# EAGLE design PTH + SMD Vibrator (EAGLE 5.08)
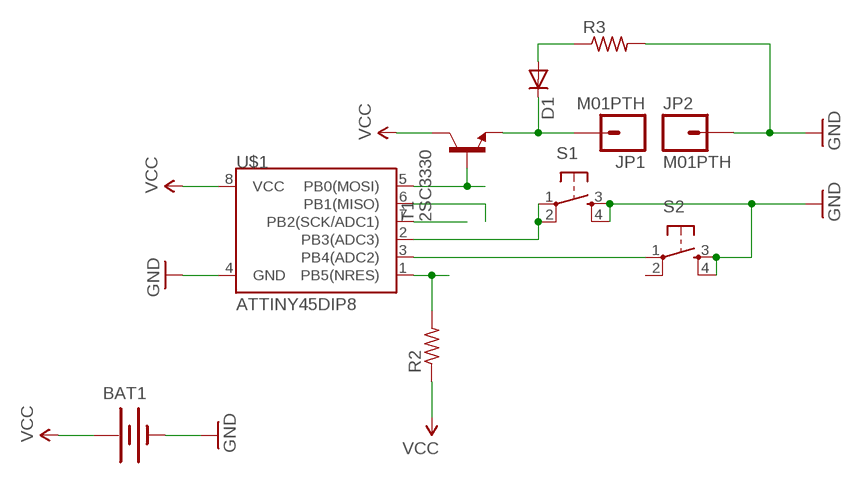
[diagram p0: schematic, sheet 1]

## Parts
BAT1  BATTERY20PTH  [BATTCOM_20MM_PTH]
D1  DIODESOD  [SOD-323]
JP1  M01PTH  [1X01]
JP2  M01PTH  [1X01]
R2  R-US_R1206  [R1206]
R3  R-US_R1206  [R1206]
S1  TAC_SWITCHPTH  [TACTILE-PTH]
S2  TAC_SWITCHPTH  [TACTILE-PTH]
T1  2SC3330  [TO92-ECB]
U$1  ATTINY45DIP8  [DIP08]

## Nets
BUTTON1_NET: S1.1 S1.2 U$1.2(PB3(ADC3))
BUTTON2_NET: S2.1 U$1.3(PB4(ADC2))
GND: BAT1.2(-) JP2.1 R3.2 S1.3 S1.4 S2.3 S2.4 U$1.4(GND)
MISO_NET: U$1.6(PB1(MISO))
MOSI_NET: T1.B U$1.5(PB0(MOSI))
N$2: D1.2(A) R3.1
N$4: D1.1(C) JP1.1 T1.E
RESET_NET: R2.2 U$1.1(PB5(NRES))
SCK_NET: U$1.7(PB2(SCK/ADC1))
VCC: BAT1.1(+) R2.1 T1.C U$1.8(VCC)
Unconnected: S2.2

## Library data of the parts
BAT1 = SparkFun:BATTERY: Battery Holders Various common sizes : AA, AAA, 20mm coin cell and 12mm coin cell.
D1 = SparkFun:DIODE: Diode These are standard reverse protection diodes and small signal diodes. SMA package can handle up to about 1A. SOD-323 can handle about 200mA. What the SOD-323 package when ordering, there are some mfgs out there that are 5-pin packages.
JP1 JP2 = SparkFun:M01: Header 1 Standard 1-pin 0.1" header. Use with straight break away headers (SKU : PRT-00116), right angle break away headers (PRT-00553), swiss pins (PRT-00743), machine pins (PRT-00117), and female headers (PRT-00115).
R2 R3 = resistor:R-US_: RESISTOR, American symbol
S1 S2 = SparkFun:TAC_SWITCH: Momentary Switch Button commonly used for reset or general input. Spark Fun Electronics SKU : COM-00097
T1 = Mine:2SC3330: NPN Silicon Epitaxial Planar Transistor Source: SEMTECH ELECTRONICS LTD. ... 2SC3330 .pdf
U$1 = SparkFun:ATTINY45: Atmel ATTiny45

## Board
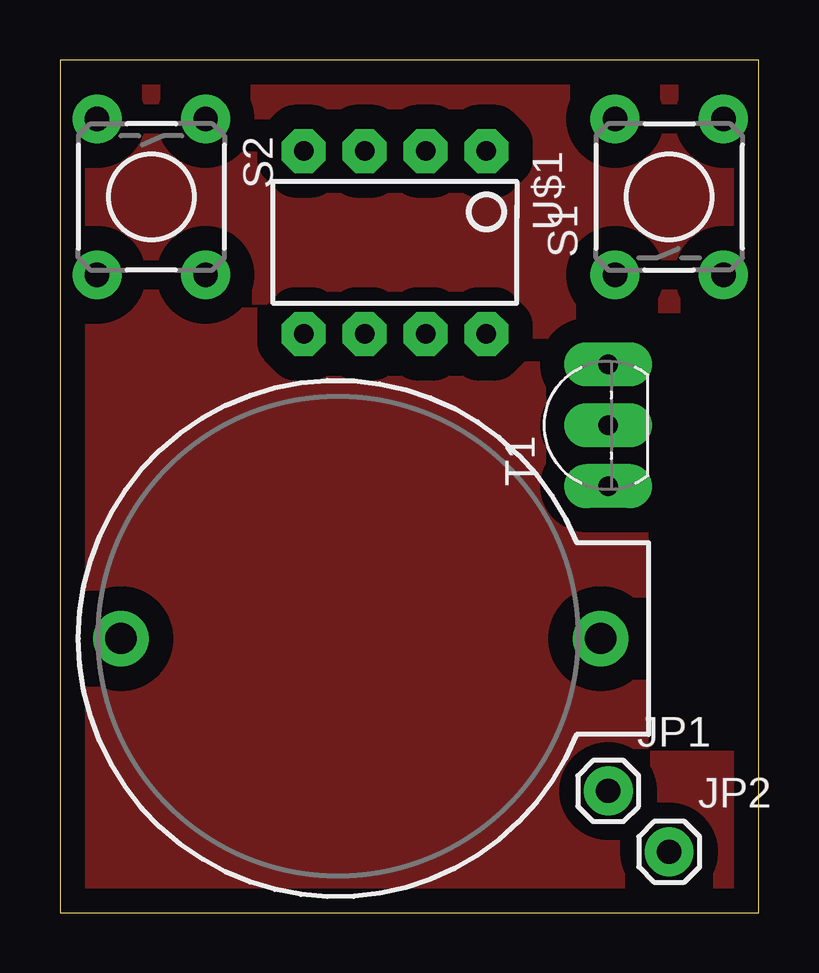
[diagram p1: board, top side]
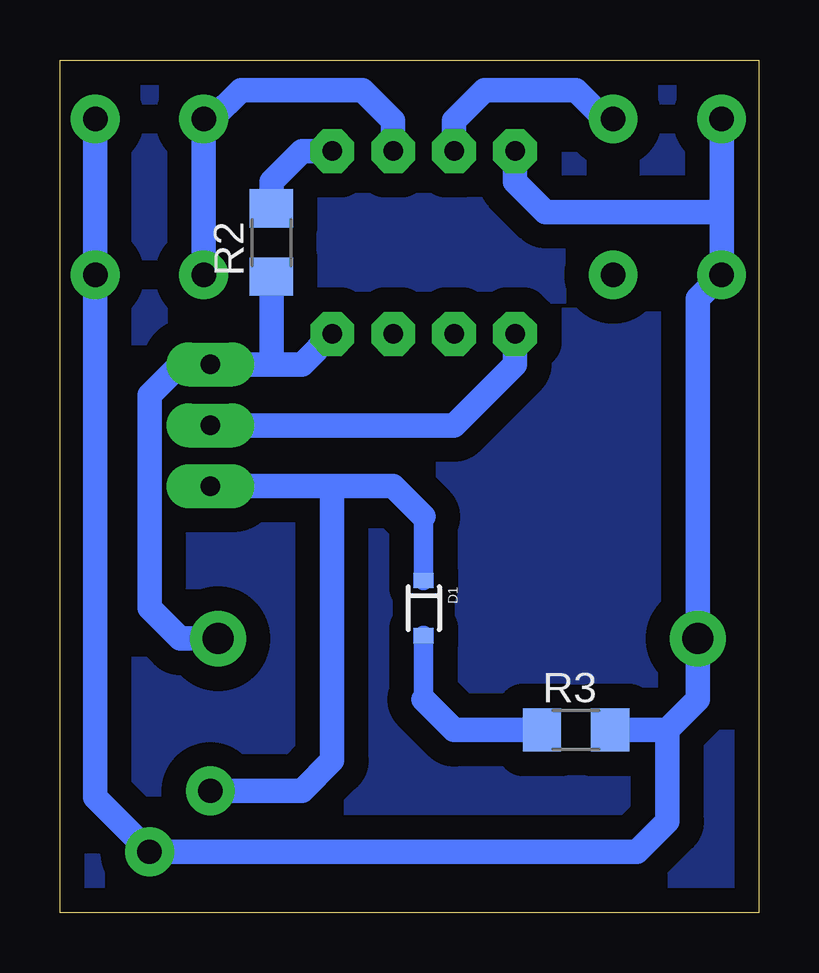
[diagram p2: board, bottom side, seen from below]

Size 29.13 x 35.55 mm. Coordinates in mm from the lower left corner, seen from the top.
Outline: 0,0 29.13,0 29.13,35.55 0,35.55 0,0
Copper layers (1*16): Top 0.035mm / dielectric 1.5mm / Bottom 0.035mm
Design rules "default *": minimum track width 31mil, minimum drill 31mil, track to track 40mil, track to pad 40mil, pad to pad 25mil, via to via 40mil, smd to smd 8mil, copper to edge 8mil, drill to drill 33mil, minimum pad ring 20mil, minimum via ring 31mil, stop-mask expansion 4mil, vias tented up to drill 0mil, thermal gap 10mil

### Footprints (pad centres in the part's own frame; a part is rotated, then mirrored left to right if it is on the bottom)
BATTCOM_20MM_PTH = drill 1.3 round: 1 20,0; 2 0,0
SOD-323 = smd 0.63 x 0.83: 1 -1.15,0; 2 1.15,0
1X01 = drill 1.016 pad 1.88 round: 1 0,0
R1206 = smd 1.6 x 1.803: 1 -1.422,0; 2 1.422,0
TACTILE-PTH = drill 1.016 pad 1.88 round: 1 -3.251,2.261; 2 3.251,2.261; 3 -3.251,-2.261; 4 3.251,-2.261
TO92-ECB = drill 0.813 long: B 0,0; C 2.54,0; E -2.54,0
DIP08 = drill 0.813 pad 1.6 octagon: 1 -3.81,-3.81; 2 -1.27,-3.81; 3 1.27,-3.81; 4 3.81,-3.81; 5 3.81,3.81; 6 1.27,3.81; 7 -1.27,3.81; 8 -3.81,3.81

### Placement (x,y rotation side)
BAT1  2.54,11.43 0 top
D1  13.97,12.7 270 bottom
JP1  22.86,5.08 0 top
JP2  25.4,2.54 0 top
R2  20.32,27.94 90 bottom
R3  7.62,7.62 0 bottom
S1  25.4,29.84 90 top
S2  3.81,29.84 270 top
T1  22.86,20.32 90 top
U$1  13.97,27.94 180 top

### Tracks (layer width: path | path; a pad name or v marks a point on that pad's centre or on a via)
BUTTON1_NET
  Bottom 1.016: S1.1 S1.2 22.78,33.1 21.59,34.29 16.51,34.29 15.24,33.02 U$1.2
BUTTON2_NET
  Bottom 1.016: S2.1 6.43,33.1 7.62,34.29 11.43,34.29 12.7,33.02 U$1.3
GND
  Bottom 1.016: 3.81,7.62 2.54,8.89 BAT1.2 2.54,25.6 S2.4 1.55,29.21 | 3.81,7.62 R3.2 6.35,7.47 | 1.55,29.21 S2.3 | 3.81,7.62 3.81,3.81 5.08,2.54 JP2.1 27.66,4.8 S1.3 S1.4 | U$1.4 10.16,30.48 8.89,29.21 1.55,29.21
MOSI_NET
  Bottom 1.016: U$1.5 10.16,22.86 12.7,20.32 T1.B
N$1
  pour Bottom (isolate 1.016): 0,35.56 29.21,35.56 29.21,1.27 0,1.27
N$2
  Bottom 0.813: 13.97,8.89 D1.2
  Bottom 1.016: R3.1 12.7,7.62 13.97,8.89
N$3
  pour Top (isolate 1.016): 0,35.56 29.21,35.56 29.21,25.4 24.13,25.4 24.13,6.35 29.21,6.35 29.21,1.27 29.21,0 0,0
N$4
  Bottom 0.813: 13.97,16.51 D1.1
  Bottom 1.016: JP1.1 19.05,5.08 17.78,6.35 17.78,17.78 | 13.97,16.51 15.24,17.78 17.78,17.78 | 17.78,17.78 T1.E
RESET_NET
  Bottom 1.016: U$1.1 19.05,31.75 20.32,30.48 R2.2
VCC
  Bottom 1.016: 20.32,22.86 T1.C 24.13,22.86 25.4,21.59 25.4,12.7 24.13,11.43 BAT1.1 | 20.32,22.86 19.05,22.86 U$1.8 | 20.32,22.86 R2.1